# Altium project Sensors_IO_Board.PrjPcb
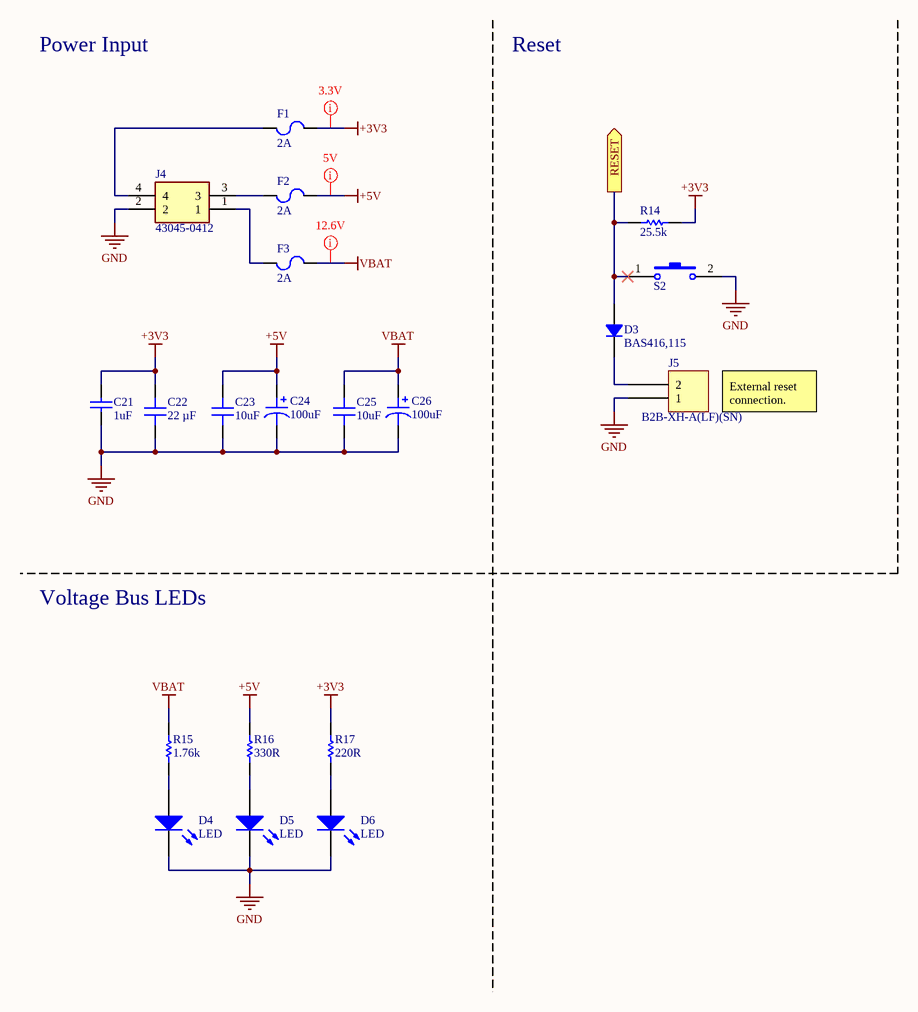
[diagram p0: Power_Reset.SchDoc]
MainProjectName: The ROS Robot Project
8 sheets, 116 parts. Net scope: hierarchical (ports join the sheet entries above them; power ports are global).
Board file: Sensors_IO_Board.PcbDoc
Sheets:
  Power_Reset.SchDoc
  Sensors_IO.SchDoc
    MS1 = Microswitch_Interface.SchDoc
    MS2 = Microswitch_Interface.SchDoc
    MS3 = Microswitch_Interface.SchDoc
    MS4 = Microswitch_Interface.SchDoc
    ULTRA1 = Ultrasonic_Interface.SchDoc
    ULTRA2 = Ultrasonic_Interface.SchDoc
    ULTRA3 = Ultrasonic_Interface.SchDoc
    ULTRA4 = Ultrasonic_Interface.SchDoc
  Aux_Power_Bus.SchDoc
  Temp_Interface.SchDoc
  Neopixel_Interface.SchDoc
  CC_LED_Drive.SchDoc

## Sheet Power_Reset.SchDoc: Power Input & Reset
size A4; DrawnBy: Samyar Sadat Akhavi; Revision: 1.0; SheetNumber: 2; SheetTotal: 13

### Parts
(Parts that share a designator on the sheet are numbered #1, #2 ... from top to bottom, then left to right.)
?#1  (no value)  (graphical)
C21  1uF  [CAP_SMD_805]
C22  22 µF  [CAP 0805_2012]
C23  10uF  [CAP 0805_2012]
C24  100uF  [CAP ALSMD 5.3MM H5.4MM]
C25  10uF  [CAP 0805_2012]
C26  100uF  [CAP ALSMD 6.6MM H5.4MM]
D3  BAS416,115  [SOD323 IPC]
D4  LED  [LED_1206]
D5  LED  [LED_1206]
D6  LED  [LED_1206]
F1  Current Rating (Amps): 2A  [FUSE 1206_3216 0.6MM]  (hidden comment: SF-1206F200-2)
F2  Current Rating (Amps): 2A  [FUSE 1206_3216 0.6MM]  (hidden comment: SF-1206F200-2)
F3  Current Rating (Amps): 2A  [FUSE 1206_3216 0.6MM]  (hidden comment: SF-1206F200-2)
J4  43045-0412  [43045-04YY_121314]
J5  B2B-XH-A(LF)(SN)  [JST XH B2B-XH-A]
R14  25.5k  [RES_0603]
R15  1.76k  [RES_0603]
R16  330R  [RES_0603]
R17  220R  [RES_0603]
S2  PTS815_SJK_250_SMTR_LFS  [PTS815SJK250SMTRLFS]  (value not drawn)

### Ports
RESET (out, see Sensors_IO_Board[2A])

### Nets
+3V3: C21.2 C22.2 F1.2 R14.2 R17.1
+5V: C23.2 C24.1 F2.2 R16.1
GND: C21.1 C22.1 C23.1 C24.2 C25.1 C26.2 D4.2(K) D5.2(K) D6.2(K) J4.2 J5.1 S2.2(NO)
VBAT: C25.2 C26.1 F3.2 R15.1
NetD3_1: D3.1 J5.2
NetD3_2: D3.2 R14.1 S2.1(COM) ; port RESET
NetD4_1: D4.1(A) R15.2
NetD5_1: D5.1(A) R16.2
NetD6_1: D6.1(A) R17.2
NetF1_1: F1.1 J4.4
NetF2_1: F2.1 J4.3
NetF3_1: F3.1 J4.1

### Layout directives
rule Supply Nets [Voltage = 5.000]: +5V
rule Supply Nets [Voltage = 3.300]: +3V3
rule Supply Nets [Voltage = 12.60]: VBAT

### Notes on the sheet
- Power Input
- Reset
- External reset connection.
- Voltage Bus LEDs
- Sub-Project:
- Size:
- Drawn By:
- Revision:
- Date:
- File:
- Sheet:
- of

### Library data of the parts
?#1 = Standard Title Block
C21 = Non-polar Capacitor: Generic Ceramic Capacitor; Voltage: 16V; Value: 1uF
C22 = CL21A226MAYNNNE: CAP CER 22UF 25V X5R 0805; manufacturer: Samsung Electro-Mechanics; Tolerance: ±20%; Part Number: CL21A226MAYNNNE; Capacitance: 22 µF; Applications: General Purpose; componentlink1description: Datasheet; componentlink1url: https://media.digikey.com/pdf/Data%20Sheets/Samsung%20PDFs/CL21A226MAYNNNE_Spec.pdf; componentlink2description: DigiKey Link; componentlink2url: https://www.digikey.com/en/products/detail/samsung-electro-mechanics/CL21A226MAYNNNE/10479857; Device Package: 0805 (2012 Metric); lastupdated: 2/9/2024 8:15:02 PM; Lifecycle Status: Active; Minimum Order: 1; Mounting Type: Surface Mount, MLCC; Operating Temperature: -55°C ~ 85°C; Package / Case: 0805 (2012 Metric); packaging: TapeAndReel; partid: 39209; Part Status: Active; price: 0.04; series: CL; Size / Dimension: 0.079" L x 0.049" W (2.00mm x 1.25mm); Supplier 1: DigiKey; Supplier Part Number 1: 1276-CL21A226MAYNNNECT-ND; Temperature Coefficient: X5R; Thickness (Max): 0.057" (1.45mm); value: 22 µF; Voltage - Rated: 25V
C23 C25 = CL21A106KOQNNNE: CAP CER 10UF 16V X5R 0805; manufacturer: Samsung Electro-Mechanics; Capacitance: 10 µF; Tolerance: ±10%; Part Number: CL21A106KOQNNNE; Applications: General Purpose; componentlink1description: Datasheet; componentlink1url: http://www.samsungsem.com/kr/support/product-search/mlcc/CL21A106KOQNNNE.jsp; componentlink2description: DigiKey Link; componentlink2url: https://www.digikey.com/en/products/detail/samsung-electro-mechanics/CL21A106KOQNNNE/3886754; Device Package: 0805 (2012 Metric); lastupdated: 2/9/2024 8:15:37 PM; Lifecycle Status: Active; Minimum Order: 1; Mounting Type: Surface Mount, MLCC; Operating Temperature: -55°C ~ 85°C; Package / Case: 0805 (2012 Metric); packaging: TapeAndReel; partid: 14297; Part Status: Active; price: 0.01; series: CL; Size / Dimension: 0.079" L x 0.049" W (2.00mm x 1.25mm); Supplier 1: DigiKey; Supplier Part Number 1: 1276-1096-1-ND; Temperature Coefficient: X5R; Thickness (Max): 0.055" (1.40mm); value: 10uF; Voltage - Rated: 16V
C24 = 865080142007: CAP ALUM 100UF 20% 6.3V SMD; manufacturer: Würth Elektronik; Capacitance: 100 µF; Impedance: 800 mOhms; Lifetime @ Temp.: 2000 Hrs @ 105°C; Polarization: Polar; Ripple Current @ High Frequency: 170 mA @ 100 kHz; Ripple Current @ Low Frequency: 110.5 mA @ 120 Hz; Surface Mount Land Size: 0.209" L x 0.209" W (5.30mm x 5.30mm); Part Number: 865080142007; Applications: General Purpose; componentlink1description: Datasheet; componentlink1url: https://katalog.we-online.de/pbs/datasheet/865080142007.pdf; componentlink2description: DigiKey Link; componentlink2url: https://www.digikey.com/en/products/detail/würth-elektronik/865080142007/5728067; Device Package: Radial, Can - SMD; Height - Seated (Max): 0.217" (5.50mm); lastupdated: 6/3/2024 7:53:12 PM; Lifecycle Status: Active; Minimum Order: 1; Mounting Type: Surface Mount; Operating Temperature: -55°C ~ 105°C; Package / Case: Radial, Can - SMD; packaging: TapeAndReel; partid: 7920; Part Status: Active; price: 0.12; series: WCAP-ASLI; Size / Dimension: 0.197" Dia (5.00mm); Supplier 1: DigiKey; Supplier Part Number 1: 732-8472-1-ND; Tolerance: ±20%; value: 100uF; Voltage - Rated: 6.3 V
C26 = 865080343009: CAP ALUM 100UF 20% 16V SMD; manufacturer: Würth Elektronik; Impedance: 520 mOhms; Lifetime @ Temp.: 2000 Hrs @ 105°C; Polarization: Polar; Ripple Current @ High Frequency: 255 mA @ 100 kHz; Ripple Current @ Low Frequency: 165.75 mA @ 120 Hz; Surface Mount Land Size: 0.260" L x 0.260" W (6.60mm x 6.60mm); Part Number: 865080343009; Applications: General Purpose; Capacitance: 100uF; componentlink1description: Datasheet; componentlink1url: https://katalog.we-online.de/pbs/datasheet/865080343009.pdf; componentlink2description: DigiKey Link; componentlink2url: https://www.digikey.com/en/products/detail/würth-elektronik/865080343009/5728014; Device Package: Radial, Can - SMD; Height - Seated (Max): 0.217" (5.50mm); lastupdated: 6/3/2024 7:53:35 PM; Lifecycle Status: Active; Minimum Order: 1; Mounting Type: Surface Mount; Operating Temperature: -55°C ~ 105°C; Package / Case: Radial, Can - SMD; packaging: TapeAndReel; partid: 8820; Part Status: Active; price: 0.16; series: WCAP-ASLI; Size / Dimension: 0.248" Dia (6.30mm); Supplier 1: DigiKey; Supplier Part Number 1: 732-8419-1-ND; Tolerance: ±20%; value: 100uF; Voltage - Rated: 16 V
D3 = BAS416,115: DIODE STANDARD 75V 200MA SOD323; Manufacturer: Nexperia USA Inc.; Capacitance @ Vr, F: 2pF @ 0V, 1MHz; Current - Reverse Leakage @ Vr: 5 nA @ 75 V; Reverse Recovery Time (trr): 3 µs; Speed: Small Signal =< 200mA (Io), Any Speed; Voltage - Forward (Vf) (Max) @ If: 1.25 V @ 150 mA; Part Number: BAS416,115; ComponentLink1Description: Datasheet; ComponentLink1URL: https://assets.nexperia.com/documents/data-sheet/BAS416.pdf; ComponentLink2Description: DigiKey Link; ComponentLink2URL: https://www.digikey.com/en/products/detail/nexperia-usa-inc/BAS416-115/1232094; Current - Average Rectified (Io): 200mA; Diode Type: Standard; LastUpdated: 10/27/2025 1:55:14 PM; Lifecycle Status: Active; Minimum Order: 1; Mounting Type: Surface Mount; Operating Temperature - Junction: 150°C (Max); Package / Case: SC-76, SOD-323; Packaging: TapeAndReel; PartId: 2951; Part Status: Active; Price: 0.02; Series: -; Supplier 1: DigiKey; Supplier Part Number 1: 1727-4807-1-ND; Supplier Device Package: SOD-323; Voltage - DC Reverse (Vr) (Max): 75 V
D4-D6 = LED: Indicator LED; Color: Blue
F1-F3 = SF-1206F200-2: FUSE BOARD MOUNT 2A 63VDC 1206; Manufacturer: Bourns Inc.; Approval Agency: UL; Breaking Capacity @ Rated Voltage: 50A; Fuse Type: Board Mount (Cartridge Style Excluded); Melting I²t: 0.181; Response Time: Fast Blow; Voltage Rating - DC: 63V; Part Number: SF-1206F200-2; Approvals: UL; ComponentLink1Description: Datasheet; ComponentLink1URL: https://www.bourns.com/pdfs/SF1206F.pdf; ComponentLink2Description: DigiKey Link; ComponentLink2URL: http://digikey.com/product-detail/en/bourns-inc/SF-1206F200-2/SF-1206F200-2CT-ND/1948205; Device Package: 1206 (3216 Metric); LastUpdated: 9/2/2020 1:30:42 AM; Lifecycle Status: Active; Minimum Order: 1; Mounting Type: Surface Mount; Operating Temperature: -40°C ~ 105°C; Package / Case: 1206 (3216 Metric); Packaging: TapeAndReel; Part Status: Active; Price: 0.31; Series: SinglFuse™ SF-1206F; Size / Dimension: 0.122" L x 0.061" W x 0.024" H (3.10mm x 1.55mm x 0.60mm); Supplier 1: DigiKey; Supplier Part Number 1: SF-1206F200-2CT-ND
J4 = 43045-0412: Connector; Manufacturer_Name: Molex; Datasheet Link: https://www.molex.com/pdm_docs/sd/430450612_sd.pdf; Height: 9.91mm; Manufacturer_Part_Number: 43045-0412; Mouser Part Number: 538-43045-0412; Mouser Price/Stock: https://www.mouser.co.uk/ProductDetail/Molex/43045-0412?qs=UeCeOHRHQebPBbEMDLocEw%3D%3D; Arrow Part Number: 43045-0412; Arrow Price/Stock: https://www.arrow.com/en/products/43045-0412/molex?utm_currency=USD&region=nac
J5 = B2B-XH-A(LF)(SN): CONN HEADER VERT 2POS 2.5MM; Manufacturer: JST Sales America Inc.; Contact Length - Post: 0.134" (3.40mm); Current Rating (Amps): 3A; Material Flammability Rating: UL94 V-0; Number of Positions: 2; Number of Positions Loaded: All; Pitch - Mating: 0.098" (2.50mm); Shrouding: Shrouded - 4 Wall; Style: Board to Cable/Wire; Voltage Rating: 250V; Part Number: B2B-XH-A(LF)(SN); ComponentLink1Description: Datasheet; ComponentLink1URL: http://www.jst-mfg.com/product/pdf/eng/eXH.pdf; ComponentLink2Description: DigiKey Link; ComponentLink2URL: http://digikey.com/product-detail/en/jst-sales-america-inc/B2B-XH-A-LF-SN/455-2247-ND/1651045; Connector Type: Header; Contact Finish - Mating: Tin; Contact Finish - Post: Tin; Contact Material: Brass; Contact Shape: Square; Contact Type: Male Pin; Fastening Type: Detent Lock; Insulation Color: Natural; Insulation Height: 0.276" (7.00mm); Insulation Material: Polyamide (PA66), Nylon 6/6; LastUpdated: 1/12/2020 11:46:08 PM; Lifecycle Status: Active; Minimum Order: 1; Mounting Type: Through Hole; Number of Rows: 1; Operating Temperature: -25°C ~ 85°C; Packaging: Bulk; PartId: 67; Part Status: Active; Price: 0.15; Series: XH; Supplier 1: DigiKey; Supplier Part Number 1: 455-2247-ND; Termination: Press-Fit, Solder
R14-R17 = Resistor: Power: 1/8W
  R14: Value: 25.5k
  R15: Value: 1.76k
  R16: Value: 330R
  R17: Value: 220R
S2 = PTS815_SJK_250_SMTR_LFS: Switch; Manufacturer_Name: C & K COMPONENTS; Manufacturer_Part_Number: PTS815 SJK 250 SMTR LFS; Datasheet Link: https://www.mouser.com/datasheet/2/60/pts815-1535658.pdf; Height: 2mm; Mouser Part Number: 611-PTS815SJK250SMTR; Mouser Price/Stock: https://www.mouser.co.uk/ProductDetail/CK/PTS815-SJK-250-SMTR-LFS?qs=ahcBuItHZ3yETpGYMHf%2FgQ%3D%3D; Arrow Part Number: PTS815 SJK 250 SMTR LFS; Arrow Price/Stock: https://www.arrow.com/en/products/pts815-sjk-250-smtr-lfs/ck

## Sheet Sensors_IO.SchDoc: Internal Sensors IO
size A4; DrawnBy: Samyar Sadat Akhavi; Revision: 1.0; SheetNumber: 4; SheetTotal: 12
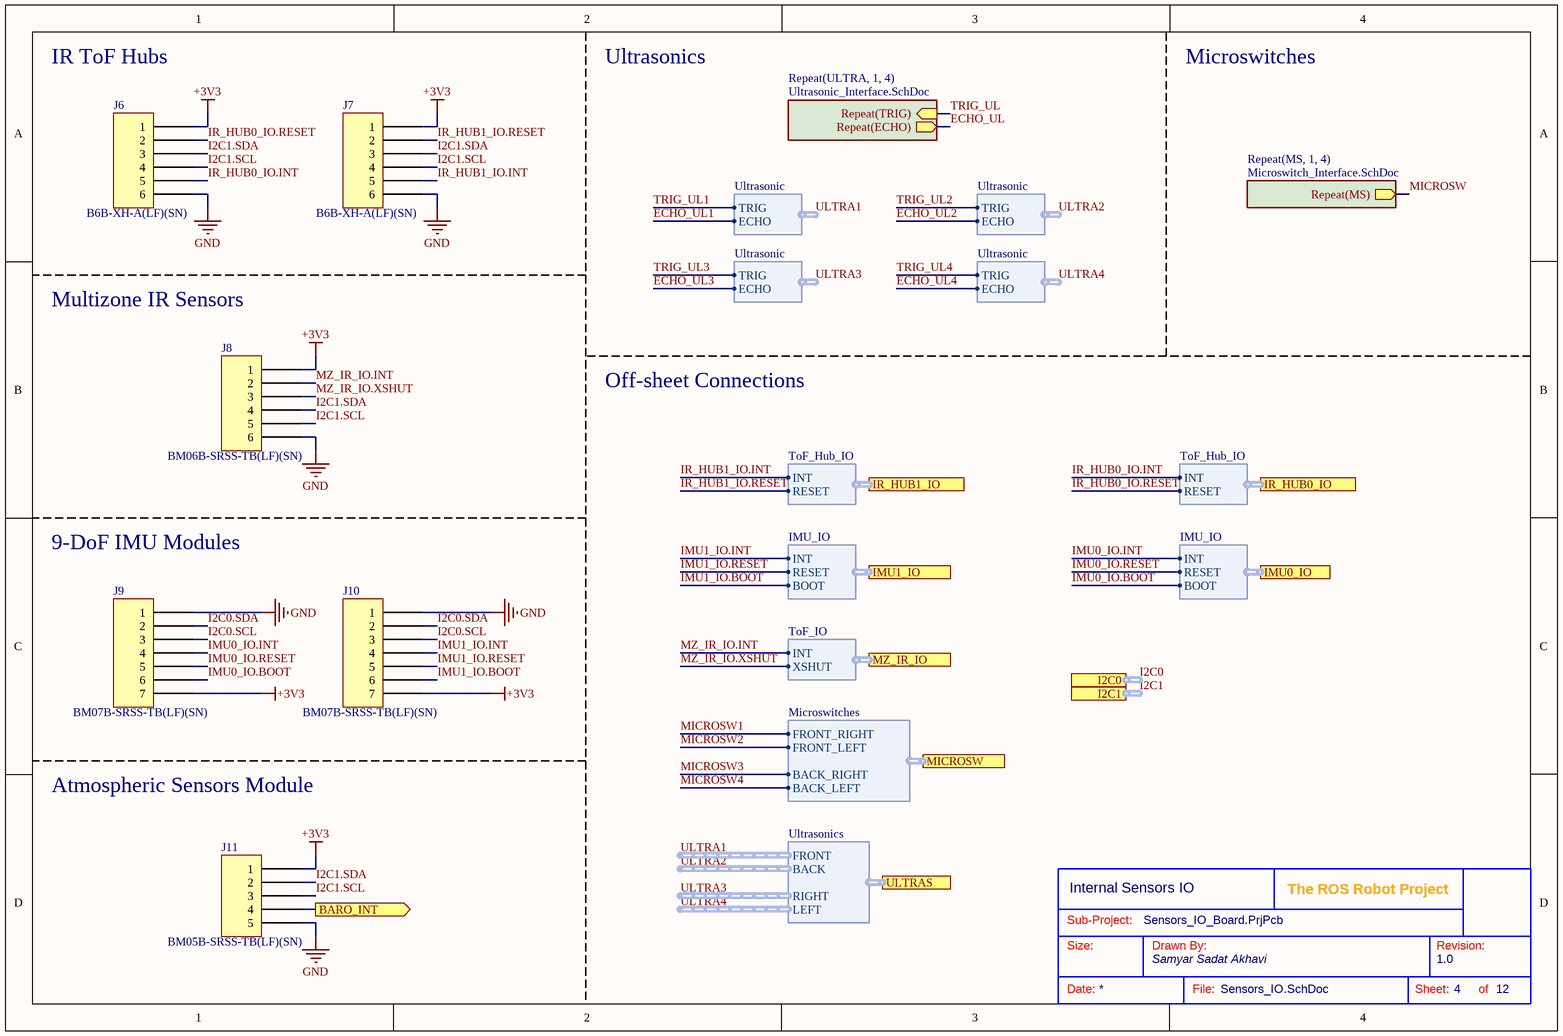
[diagram p1: Sensors_IO.SchDoc]

### Parts
(Parts that share a designator on the sheet are numbered #1, #2 ... from top to bottom, then left to right.)
?#2  (no value)  (graphical)
J6  B6B-XH-A(LF)(SN)  [JST XH B6B-XH-A]
J7  B6B-XH-A(LF)(SN)  [JST XH B6B-XH-A]
J8  BM06B-SRSS-TB(LF)(SN)  [JST BM06B-SRSS-TB]
J9  BM07B-SRSS-TB(LF)(SN)  [JST BM07B-SRSS-TB]
J10  BM07B-SRSS-TB(LF)(SN)  [JST BM07B-SRSS-TB]
J11  BM05B-SRSS-TB(LF)(SN)  [JST BM05B-SRSS-TB]

### Sub-sheets
Repeat(MS, 1, 4) = Microswitch_Interface.SchDoc: Repeat(MS) (out)
Repeat(ULTRA, 1, 4) = Ultrasonic_Interface.SchDoc: Repeat(TRIG) (in), Repeat(ECHO) (out)

### Ports
BARO_INT (out, see Sensors_IO_Board[2B], Microcontroller[3B]), I2C0 (harness I2C, see Sensors_IO_Board[2B], Aux_Power_Bus[4C], Microcontroller[5C], Thermal[4C]), I2C1 (harness I2C, see Sensors_IO_Board[2B], Microcontroller[6C], Thermal[4C]), IMU0_IO (harness IMU_IO, see Sensors_IO_Board[2B], Microcontroller[3B]), IMU1_IO (harness IMU_IO, see Sensors_IO_Board[2B], Microcontroller[3B]), IR_HUB0_IO (harness TOF_HUB_IO, see Sensors_IO_Board[2B], Microcontroller[3B]), IR_HUB1_IO (harness TOF_HUB_IO, see Sensors_IO_Board[2B], Microcontroller[3B]), MICROSW (harness Microswitches, see Sensors_IO_Board[2B], Microcontroller[3B]), MZ_IR_IO (harness TOF_IO, see Sensors_IO_Board[2B], Microcontroller[3B]), ULTRAS (harness Ultrasonics, see Sensors_IO_Board[2B], Microcontroller[3B])

### Harnesses
Microswitches: BACK_LEFT, FRONT_RIGHT, FRONT_LEFT, BACK_RIGHT
IMU_IO: INT, RESET, BOOT
ToF_IO: INT, XSHUT
ToF_Hub_IO: INT, RESET
Ultrasonics: LEFT, FRONT, BACK, RIGHT
Ultrasonic: TRIG, ECHO

### Nets
+3V3: J6.1 J7.1 J8.1 J9.7 J10.7 J11.1
GND: J6.6 J7.6 J8.6 J9.1 J10.1 J11.5
ECHO_UL: sheet Repeat(ULTRA, 1, 4)/Repeat(ECHO)
I2C0.SCL: J9.3 J10.3
I2C0.SDA: J9.2 J10.2
I2C1.SCL: J6.4 J7.4 J8.5 J11.3
I2C1.SDA: J6.3 J7.3 J8.4 J11.2
IMU0_IO.BOOT: J9.6 ; port IMU0_IO.BOOT
IMU0_IO.INT: J9.4 ; port IMU0_IO.INT
IMU0_IO.RESET: J9.5 ; port IMU0_IO.RESET
IMU1_IO.BOOT: J10.6 ; port IMU1_IO.BOOT
IMU1_IO.INT: J10.4 ; port IMU1_IO.INT
IMU1_IO.RESET: J10.5 ; port IMU1_IO.RESET
IR_HUB0_IO.INT: J6.5 ; port IR_HUB0_IO.INT
IR_HUB0_IO.RESET: J6.2 ; port IR_HUB0_IO.RESET
IR_HUB1_IO.INT: J7.5 ; port IR_HUB1_IO.INT
IR_HUB1_IO.RESET: J7.2 ; port IR_HUB1_IO.RESET
MICROSW: sheet Repeat(MS, 1, 4)/Repeat(MS)
MZ_IR_IO.INT: J8.2 ; port MZ_IR_IO.INT
MZ_IR_IO.XSHUT: J8.3 ; port MZ_IR_IO.XSHUT
TRIG_UL: sheet Repeat(ULTRA, 1, 4)/Repeat(TRIG)
NetJ11_4: J11.4 ; port BARO_INT

### Buses and harness runs
harness I2C0 = port I2C0
harness I2C1 = port I2C1

### Notes on the sheet
- IR ToF Hubs
- Ultrasonics
- Microswitches
- Multizone IR Sensors
- Off-sheet Connections
- 9-DoF IMU Modules
- Atmospheric Sensors Module
- Sub-Project:
- Size:
- Drawn By:
- Revision:
- Date:
- File:
- Sheet:
- of

### Library data of the parts
?#2 = Standard Title Block
J6 J7 = B6B-XH-A(LF)(SN): CONN HEADER VERT 6POS 2.5MM; Manufacturer: JST Sales America Inc.; Contact Length - Post: 0.134" (3.40mm); Current Rating (Amps): 3A; Material Flammability Rating: UL94 V-0; Number of Positions: 6; Number of Positions Loaded: All; Pitch - Mating: 0.098" (2.50mm); Shrouding: Shrouded - 4 Wall; Style: Board to Cable/Wire; Voltage Rating: 250V; Part Number: B6B-XH-A(LF)(SN); ComponentLink1Description: Datasheet; ComponentLink1URL: http://www.jst-mfg.com/product/pdf/eng/eXH.pdf; ComponentLink2Description: DigiKey Link; ComponentLink2URL: http://digikey.com/product-detail/en/jst-sales-america-inc/B6B-XH-A-LF-SN/455-2271-ND/1000381; Connector Type: Header; Contact Finish - Mating: Tin; Contact Finish - Post: Tin; Contact Material: Brass; Contact Shape: Square; Contact Type: Male Pin; Fastening Type: Detent Lock; Insulation Color: Natural; Insulation Height: 0.276" (7.00mm); Insulation Material: Polyamide (PA66), Nylon 6/6; LastUpdated: 1/12/2020 11:46:58 PM; Lifecycle Status: Active; Minimum Order: 1; Mounting Type: Through Hole; Number of Rows: 1; Operating Temperature: -25°C ~ 85°C; Packaging: Bulk; PartId: 71; Part Status: Active; Price: 0.27; Series: XH; Supplier 1: DigiKey; Supplier Part Number 1: 455-2271-ND; Termination: Press-Fit, Solder
J8 = BM06B-SRSS-TB(LF)(SN): CONN HEADER SMD 6POS 1MM; Manufacturer: JST Sales America Inc.; Current Rating (Amps): 0.7A; Material Flammability Rating: UL94 V-0; Number of Positions: 6; Number of Positions Loaded: All; Pitch - Mating: 0.039" (1.00mm); Shrouding: Shrouded - 4 Wall; Style: Board to Cable/Wire; Voltage Rating: 50V; Part Number: BM06B-SRSS-TB(LF)(SN); ComponentLink1Description: Datasheet; ComponentLink1URL: http://www.jst-mfg.com/product/pdf/eng/eSH.pdf; ComponentLink2Description: DigiKey Link; ComponentLink2URL: http://digikey.com/product-detail/en/jst-sales-america-inc/BM06B-SRSS-TB-LF-SN/455-1792-1-ND/926863; Connector Type: Header; Contact Finish - Mating: Tin; Contact Finish - Post: Tin; Contact Material: Copper Alloy; Contact Shape: Square; Contact Type: Male Pin; Fastening Type: Push-Pull; Features: Solder Retention; Insulation Color: Natural; Insulation Height: 0.167" (4.25mm); Insulation Material: Polyamide (PA), Nylon; LastUpdated: 1/12/2020 10:14:30 PM; Lifecycle Status: Active; Minimum Order: 1; Mounting Type: Surface Mount; Number of Rows: 1; Operating Temperature: -25°C ~ 85°C; Packaging: TapeAndReel; PartId: 20; Part Status: Active; Price: 0.38; Series: SR; Supplier 1: DigiKey; Supplier Part Number 1: 455-1792-1-ND; Termination: Solder
J9 J10 = BM07B-SRSS-TB(LF)(SN): CONN HEADER SMD 7POS 1MM; Manufacturer: JST Sales America Inc.; Current Rating (Amps): 0.7A; Material Flammability Rating: UL94 V-0; Number of Positions: 7; Number of Positions Loaded: All; Pitch - Mating: 0.039" (1.00mm); Shrouding: Shrouded - 4 Wall; Style: Board to Cable/Wire; Voltage Rating: 50V; Part Number: BM07B-SRSS-TB(LF)(SN); ComponentLink1Description: Datasheet; ComponentLink1URL: http://www.jst-mfg.com/product/pdf/eng/eSH.pdf; ComponentLink2Description: DigiKey Link; ComponentLink2URL: http://digikey.com/product-detail/en/jst-sales-america-inc/BM07B-SRSS-TB-LF-SN/455-1793-1-ND/926864; Connector Type: Header; Contact Finish - Mating: Tin; Contact Finish - Post: Tin; Contact Material: Copper Alloy; Contact Shape: Square; Contact Type: Male Pin; Fastening Type: Push-Pull; Features: Solder Retention; Insulation Color: Natural; Insulation Height: 0.167" (4.25mm); Insulation Material: Polyamide (PA), Nylon; LastUpdated: 1/12/2020 10:15:04 PM; Lifecycle Status: Active; Minimum Order: 1; Mounting Type: Surface Mount; Number of Rows: 1; Operating Temperature: -25°C ~ 85°C; Packaging: TapeAndReel; PartId: 22; Part Status: Active; Price: 0.42; Series: SR; Supplier 1: DigiKey; Supplier Part Number 1: 455-1793-1-ND; Termination: Solder
J11 = BM05B-SRSS-TB(LF)(SN): CONN HEADER SMD 5POS 1MM; Manufacturer: JST Sales America Inc.; Current Rating (Amps): 0.7A; Material Flammability Rating: UL94 V-0; Number of Positions: 5; Number of Positions Loaded: All; Pitch - Mating: 0.039" (1.00mm); Shrouding: Shrouded - 4 Wall; Style: Board to Cable/Wire; Voltage Rating: 50V; Part Number: BM05B-SRSS-TB(LF)(SN); ComponentLink1Description: Datasheet; ComponentLink1URL: http://www.jst-mfg.com/product/pdf/eng/eSR.pdf; ComponentLink2Description: DigiKey Link; ComponentLink2URL: http://digikey.com/product-detail/en/jst-sales-america-inc/BM05B-SRSS-TB-LF-SN/455-1791-1-ND/926862; Connector Type: Header; Contact Finish - Mating: Tin; Contact Finish - Post: Tin; Contact Material: Copper Alloy; Contact Shape: Square; Contact Type: Male Pin; Fastening Type: Push-Pull; Features: Solder Retention; Insulation Color: Natural; Insulation Height: 0.167" (4.25mm); Insulation Material: Polyamide (PA), Nylon; LastUpdated: 1/12/2020 10:14:00 PM; Lifecycle Status: Active; Minimum Order: 1; Mounting Type: Surface Mount; Number of Rows: 1; Operating Temperature: -25°C ~ 85°C; Packaging: TapeAndReel; PartId: 18; Part Status: Active; Price: 0.35; Series: SR; Supplier 1: DigiKey; Supplier Part Number 1: 455-1791-1-ND; Termination: Solder

## Sheet Microswitch_Interface.SchDoc: Microswitch Interface
size A4; DrawnBy: Samyar Sadat Akhavi; Revision: 1.0; SheetNumber: 7; SheetTotal: 14
Used 4 times, as channels MS1, MS2, MS3, MS4. Parts and nets are listed once, with the designators drawn on the sheet.
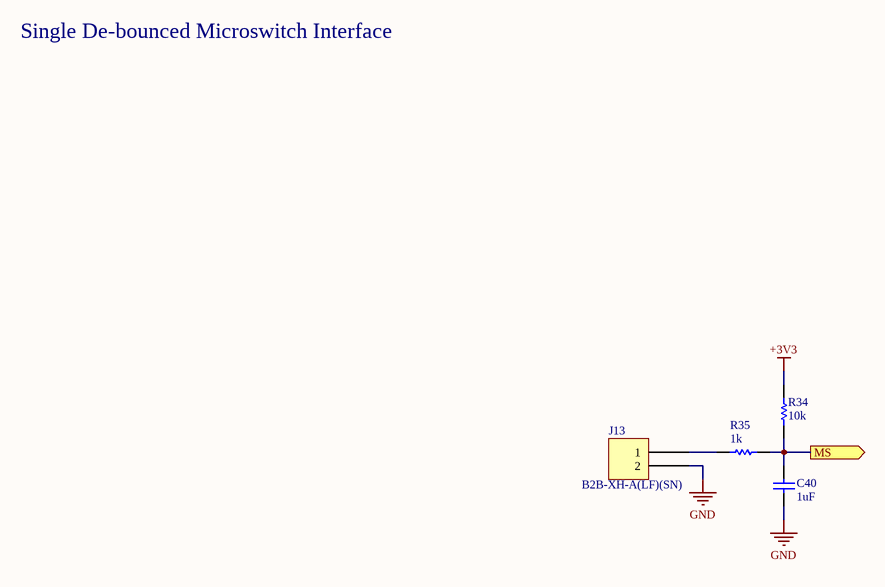
[diagram p2: Microswitch_Interface.SchDoc]

### Parts
?  (no value)  (graphical)
C40  1uF  [CAP_SMD_603]
J13  B2B-XH-A(LF)(SN)  [JST XH B2B-XH-A]
R34  10k  [RES_0603]
R35  1k  [RES_0603]

### Ports
MS (out, see Sensors_IO[4A])

### Nets
+3V3: R34.1
GND: C40.2 J13.2
MS: C40.1 R34.2 R35.1 ; port MS
NetJ13_1: J13.1 R35.2

### Channels
MS1: designators end in _MS1; ports MS=MICROSW1
MS2: designators end in _MS2; ports MS=MICROSW2
MS3: designators end in _MS3; ports MS=MICROSW3
MS4: designators end in _MS4; ports MS=MICROSW4

### Notes on the sheet
- Single De-bounced Microswitch Interface
- Sub-Project:
- Size:
- Drawn By:
- Revision:
- Date:
- File:
- Sheet:
- of

### Library data of the parts
? = Standard Title Block
C40 = Non-polar Capacitor: Generic Ceramic Capacitor; Voltage: 6.3V; Value: 1uF
J13 = B2B-XH-A(LF)(SN): as J5 on sheet Power_Reset; Part Number: B2B-XH-A(LF)(SN); ComponentLink1Description: Datasheet; ComponentLink1URL: http://www.jst-mfg.com/product/pdf/eng/eXH.pdf; ComponentLink2Description: DigiKey Link; ComponentLink2URL: http://digikey.com/product-detail/en/jst-sales-america-inc/B2B-XH-A-LF-SN/455-2247-ND/1651045; Connector Type: Header; Contact Finish - Mating: Tin; Contact Finish - Post: Tin; Contact Material: Brass; Contact Shape: Square; Contact Type: Male Pin; Fastening Type: Detent Lock; Insulation Color: Natural; Insulation Height: 0.276" (7.00mm); Insulation Material: Polyamide (PA66), Nylon 6/6; LastUpdated: 1/12/2020 11:46:08 PM; Lifecycle Status: Active; Minimum Order: 1; Mounting Type: Through Hole; Number of Rows: 1; Operating Temperature: -25°C ~ 85°C; Packaging: Bulk; PartId: 67; Part Status: Active; Price: 0.15; Series: XH; Supplier 1: DigiKey; Supplier Part Number 1: 455-2247-ND; Termination: Press-Fit, Solder
R34 R35 = Resistor: Power: 1/8W
  R34: Value: 10k
  R35: Value: 1k

## Sheet Ultrasonic_Interface.SchDoc: 5V Ultrasonic Interface
size A4; DrawnBy: Samyar Sadat Akhavi; Revision: 1.0; SheetNumber: 5; SheetTotal: 13
Used 4 times, as channels ULTRA1, ULTRA2, ULTRA3, ULTRA4. Parts and nets are listed once, with the designators drawn on the sheet.
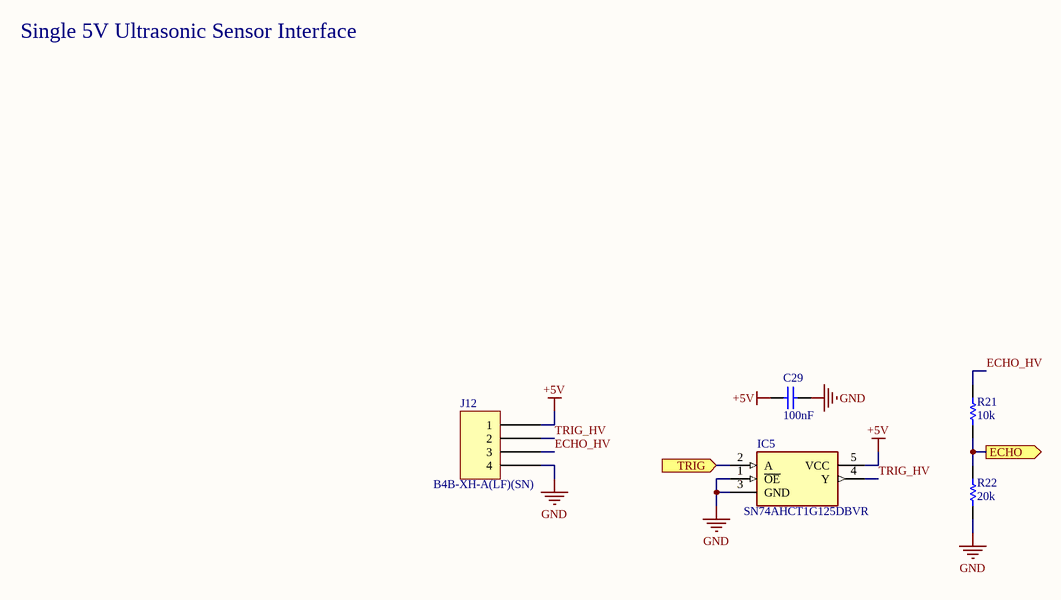
[diagram p3: Ultrasonic_Interface.SchDoc]

### Parts
?  (no value)  (graphical)
C29  100nF  [CAP_SMD_603]
IC5  SN74AHCT1G125DBVR  [SOT95P280X145-5N]
J12  B4B-XH-A(LF)(SN)  [JST XH B4B-XH-A]
R21  10k  [RES_0603]
R22  20k  [RES_0603]

### Ports
ECHO (out, see Sensors_IO[3A]), TRIG (in, see Sensors_IO[3A])

### Nets
+5V: C29.2 IC5.5(VCC) J12.1
GND: C29.1 IC5.1(~{OE}) IC5.3(GND) J12.4 R22.2
ECHO: R21.2 R22.1 ; port ECHO
ECHO_HV: J12.3 R21.1
TRIG: IC5.2(A) ; port TRIG
TRIG_HV: IC5.4(Y) J12.2

### Channels
ULTRA1: designators end in _ULTRA1; ports ECHO=ECHO_UL1 TRIG=TRIG_UL1
ULTRA2: designators end in _ULTRA2; ports ECHO=ECHO_UL2 TRIG=TRIG_UL2
ULTRA3: designators end in _ULTRA3; ports ECHO=ECHO_UL3 TRIG=TRIG_UL3
ULTRA4: designators end in _ULTRA4; ports ECHO=ECHO_UL4 TRIG=TRIG_UL4

### Notes on the sheet
- Single 5V Ultrasonic Sensor Interface
- Sub-Project:
- Size:
- Drawn By:
- Revision:
- Date:
- File:
- Sheet:
- of

### Library data of the parts
? = Standard Title Block
C29 = Non-polar Capacitor: Generic Ceramic Capacitor; Voltage: 6.3V; Value: 100nF
IC5 = SN74AHCT1G125DBVR: Integrated Circuit; Manufacturer_Name: Texas Instruments; Datasheet Link: http://www.ti.com/lit/ds/symlink/sn74ahct1g125.pdf; Height: 1.45mm; Manufacturer_Part_Number: SN74AHCT1G125DBVR; Mouser Part Number: 595-SNAHCT1G125DBVR; Mouser Price/Stock: https://www.mouser.co.uk/ProductDetail/Texas-Instruments/SN74AHCT1G125DBVR?qs=N6WZOzgtpqVaVW8Lh%252BgevA%3D%3D; Arrow Part Number: SN74AHCT1G125DBVR; Arrow Price/Stock: https://www.arrow.com/en/products/sn74ahct1g125dbvr/texas-instruments?utm_currency=USD&region=nac
J12 = B4B-XH-A(LF)(SN): CONN HEADER VERT 4POS 2.5MM; Manufacturer: JST Sales America Inc.; Contact Length - Post: 0.134" (3.40mm); Current Rating (Amps): 3A; Material Flammability Rating: UL94 V-0; Number of Positions: 4; Number of Positions Loaded: All; Pitch - Mating: 0.098" (2.50mm); Shrouding: Shrouded - 4 Wall; Style: Board to Cable/Wire; Voltage Rating: 250V; Part Number: B4B-XH-A(LF)(SN); ComponentLink1Description: Datasheet; ComponentLink1URL: http://www.jst-mfg.com/product/pdf/eng/eXH.pdf; ComponentLink2Description: DigiKey Link; ComponentLink2URL: http://digikey.com/product-detail/en/jst-sales-america-inc/B4B-XH-A-LF-SN/455-2249-ND/1651047; Connector Type: Header; Contact Finish - Mating: Tin; Contact Finish - Post: Tin; Contact Material: Brass; Contact Shape: Square; Contact Type: Male Pin; Fastening Type: Detent Lock; Insulation Color: Natural; Insulation Height: 0.276" (7.00mm); Insulation Material: Polyamide (PA66), Nylon 6/6; LastUpdated: 1/12/2020 11:46:34 PM; Lifecycle Status: Active; Minimum Order: 1; Mounting Type: Through Hole; Number of Rows: 1; Operating Temperature: -25°C ~ 85°C; Packaging: Bulk; PartId: 69; Part Status: Active; Price: 0.21; Series: XH; Supplier 1: DigiKey; Supplier Part Number 1: 455-2249-ND; Termination: Press-Fit, Solder
R21 R22 = Resistor: Power: 1/8W
  R21: Value: 10k
  R22: Value: 20k

## Sheet Aux_Power_Bus.SchDoc: Auxiliary 5V & VBAT Busses
size A4; DrawnBy: Samyar Sadat Akhavi; Revision: 1.0; SheetNumber: 7; SheetTotal: 14
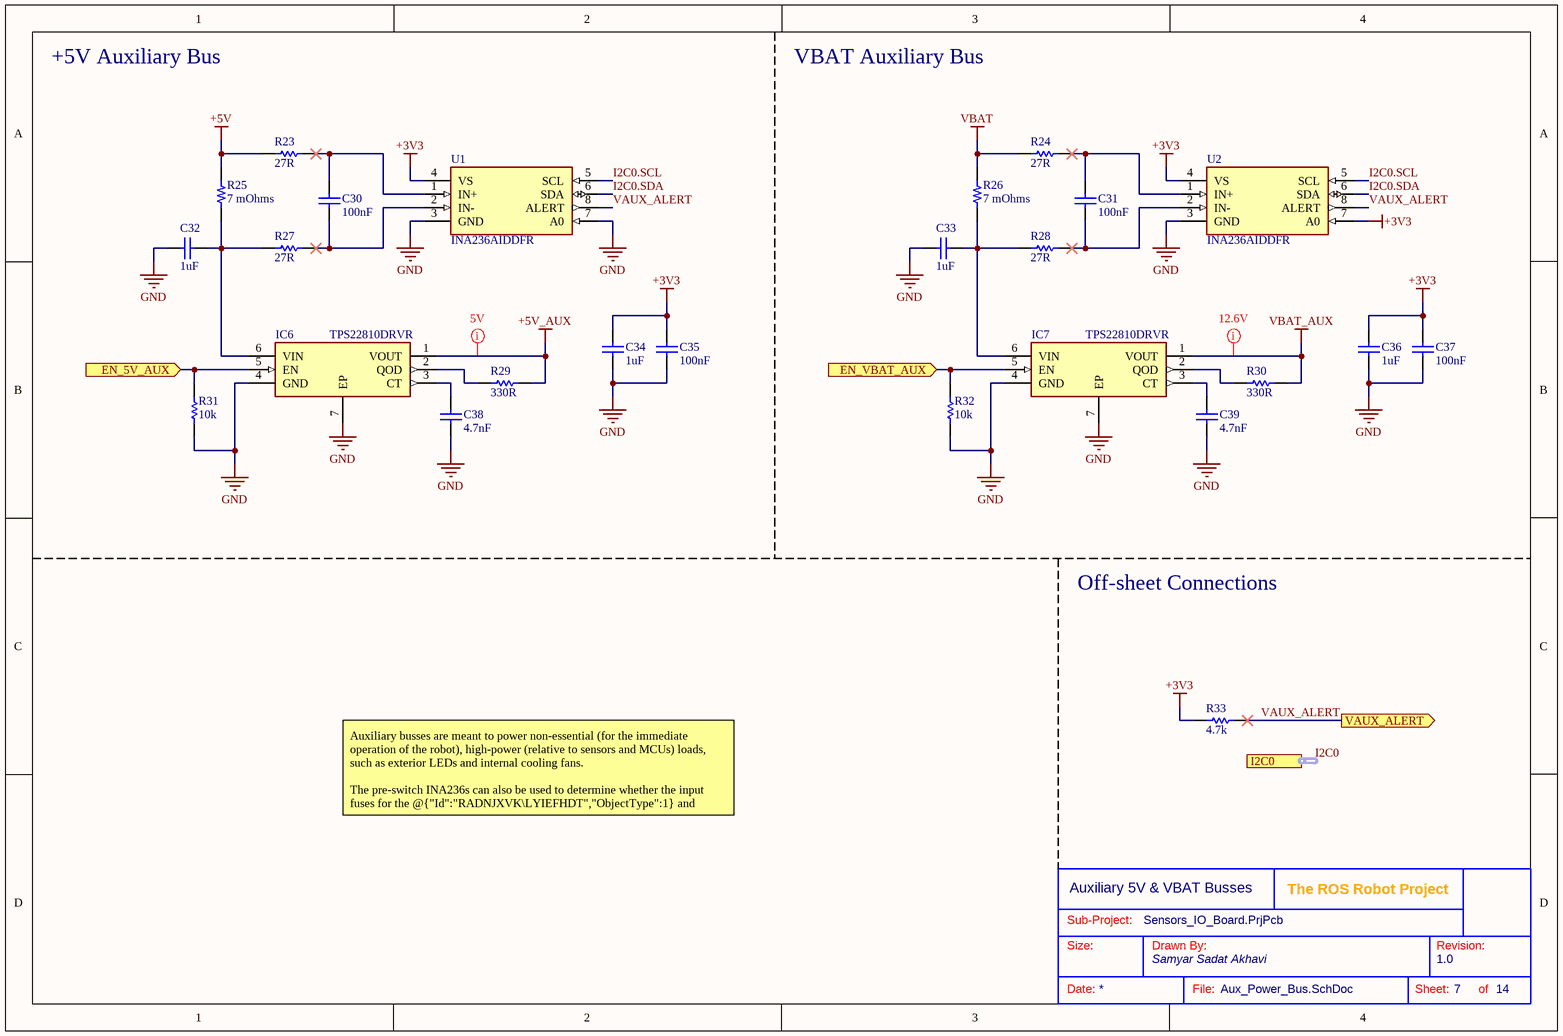
[diagram p4: Aux_Power_Bus.SchDoc]

### Parts
(Parts that share a designator on the sheet are numbered #1, #2 ... from top to bottom, then left to right.)
?#3  (no value)  (graphical)
C30  100nF  [CAP_SMD_603]
C31  100nF  [CAP_SMD_603]
C32  1uF  [CAP_SMD_603]
C33  1uF  [CAP_SMD_603]
C34  1uF  [CAP_SMD_603]
C35  100nF  [CAP_SMD_603]
C36  1uF  [CAP_SMD_603]
C37  100nF  [CAP_SMD_603]
C38  4.7nF  [CAP_SMD_603]
C39  4.7nF  [CAP_SMD_603]
IC6  TPS22810DRVR  [SON65P200X200X80-7N]
IC7  TPS22810DRVR  [SON65P200X200X80-7N]
R23  27R  [RES_0603]
R24  27R  [RES_0603]
R25  7 mOhms  [RES 1206_3216]
R26  7 mOhms  [RES 1206_3216]
R27  27R  [RES_0603]
R28  27R  [RES_0603]
R29  330R  [RES_0603]
R30  330R  [RES_0603]
R31  10k  [RES_0603]
R32  10k  [RES_0603]
R33  4.7k  [RES_0603]
U1  INA236AIDDFR  [SOT23-8_DDF_TEX]
U2  INA236AIDDFR  [SOT23-8_DDF_TEX]

### Ports
EN_5V_AUX (in, see Sensors_IO_Board[3A]), EN_VBAT_AUX (in, see Sensors_IO_Board[3A]), I2C0 (harness I2C, see Sensors_IO_Board[4A], Microcontroller[5C], Sensors_IO[3C], Thermal[4C]), VAUX_ALERT (out, see Sensors_IO_Board[3A], Microcontroller[3C])

### Nets
+3V3: C34.2 C35.1 C36.2 C37.1 R33.1 U1.4(VS) U2.4(VS) U2.7(A0)
+5V: R23.2 R25.2
+5V_AUX: IC6.1(VOUT) R29.1
GND: C32.1 C33.1 C34.1 C35.2 C36.1 C37.2 C38.1 C39.1 IC6.4(GND) IC6.7(EP) IC7.4(GND) IC7.7(EP) R31.2 R32.2 U1.3(GND) U1.7(A0) U2.3(GND)
VBAT: R24.2 R26.2
VBAT_AUX: IC7.1(VOUT) R30.1
I2C0.SCL: U1.5(SCL) U2.5(SCL)
I2C0.SDA: U1.6(SDA) U2.6(SDA)
VAUX_ALERT: R33.2 U1.8(ALERT) U2.8(ALERT) ; port VAUX_ALERT
NetC30_1: C30.1 R23.1 U1.1(IN+)
NetC30_2: C30.2 R27.1 U1.2(IN-)
NetC31_1: C31.1 R24.1 U2.1(IN+)
NetC31_2: C31.2 R28.1 U2.2(IN-)
NetC32_2: C32.2 IC6.6(VIN) R25.1 R27.2
NetC33_2: C33.2 IC7.6(VIN) R26.1 R28.2
NetC38_2: C38.2 IC6.3(CT)
NetC39_2: C39.2 IC7.3(CT)
NetIC6_2: IC6.2(QOD) R29.2
NetIC6_5: IC6.5(EN) R31.1 ; port EN_5V_AUX
NetIC7_2: IC7.2(QOD) R30.2
NetIC7_5: IC7.5(EN) R32.1 ; port EN_VBAT_AUX

### Buses and harness runs
harness I2C0 = port I2C0

### Layout directives
rule Supply Nets [Voltage = 5.000]: +5V_AUX
rule Supply Nets [Voltage = 12.60]: VBAT_AUX

### Notes on the sheet
- +5V Auxiliary Bus
- VBAT Auxiliary Bus
- Off-sheet Connections
- Auxiliary busses are meant to power non-essential (for the immediate operation of the robot), high-power (relative to sensors and MCUs) loads, such as exterior LEDs and internal cooling fans.
  The pre-switch INA236s can also be used to determine whether the input fuses for the @{"Id":"RADNJXVK\LYIEFHDT","ObjectType":1} and @{"Id":"RADNJXVK\DFYGACVF","ObjectType":1} busses have blown or not.
- Sub-Project:
- Size:
- Drawn By:
- Revision:
- Date:
- File:
- Sheet:
- of

### Library data of the parts
?#3 = Standard Title Block
C30 C31 C35 C37-C39 = Non-polar Capacitor: Generic Ceramic Capacitor; Voltage: 6.3V
  C30 C31 C35 C37: Value: 100nF
  C38 C39: Value: 4.7nF
C32 C34 C36 = Non-polar Capacitor: Generic Ceramic Capacitor; Voltage: 16; Value: 1uF
C33 = Non-polar Capacitor: Generic Ceramic Capacitor; Voltage: 16V; Value: 1uF
IC6 IC7 = TPS22810DRVR: Integrated Circuit; Manufacturer_Name: Texas Instruments; Datasheet Link: http://www.ti.com/lit/gpn/tps22810; Height: 0.8mm; Manufacturer_Part_Number: TPS22810DRVR; Mouser Part Number: 595-TPS22810DRVR; Mouser Price/Stock: https://www.mouser.co.uk/ProductDetail/Texas-Instruments/TPS22810DRVR?qs=5aG0NVq1C4wkfnc1%252B6LezA%3D%3D; Arrow Part Number: TPS22810DRVR; Arrow Price/Stock: https://www.arrow.com/en/products/tps22810drvr/texas-instruments?region=nac
R23 R24 R27 R28 R31-R33 = Resistor: Power: 1/8W
  R23 R24 R27 R28: Value: 27R
  R31 R32: Value: 10k
  R33: Value: 4.7k
R25 R26 = TLR2B10DR007FTDG: RES 0.007 OHM 1% 1W 1206; Manufacturer: TE Connectivity Passive Product; Temperature Coefficient: ±50ppm/°C; Part Number: TLR2B10DR007FTDG; ComponentLink1Description: Datasheet; ComponentLink1URL: https://www.te.com/commerce/DocumentDelivery/DDEController?Action=srchrtrv&DocNm=1773449-3&DocType=DS&DocLang=English; ComponentLink2Description: DigiKey Link; ComponentLink2URL: https://www.digikey.com/en/products/detail/te-connectivity-passive-product/TLR2B10DR007FTDG/5584869; Composition: Metal Foil; Device Package: 1206 (3216 Metric); Features: Current Sense; Height - Seated (Max): 0.024" (0.60mm); LastUpdated: 2/9/2024 8:54:43 PM; Lifecycle Status: Active; Minimum Order: 1; Number of Terminations: 2; Operating Temperature: -55°C ~ 170°C; Package / Case: 1206 (3216 Metric); Packaging: TapeAndReel; PartId: 27144; Part Status: Active; Power (Watts): 1W; Price: 0.31; Resistance: 7 mOhms; Series: TLR, CGS; Size / Dimension: 0.126" L x 0.063" W (3.20mm x 1.60mm); Supplier 1: DigiKey; Supplier Part Number 1: A131747CT-ND; Supplier Device Package: 1206; Tolerance: ±1%; Value: 7 mOhms
R29 R30 = Resistor: Power: 1/4W; Value: 330R
U1 U2 = INA236AIDDFR: 48-V, 16-bit ultraprecise IÂ²C output digital power monitor with alert in WCSP 8-SOT-23-THIN -40 to 125; Manufacturer_Name: Texas Instruments; Type: Power Management; Copyright: Copyright (C) 2025 Ultra Librarian. All rights reserved.; Manufacturer_Part_Number: INA236AIDDFR; RefDes: RefDes

## Sheet Temp_Interface.SchDoc: NTC Thermistor Interface
size A4; DrawnBy: Samyar Sadat Akhavi; Revision: 1.0; SheetNumber: 9; SheetTotal: 13
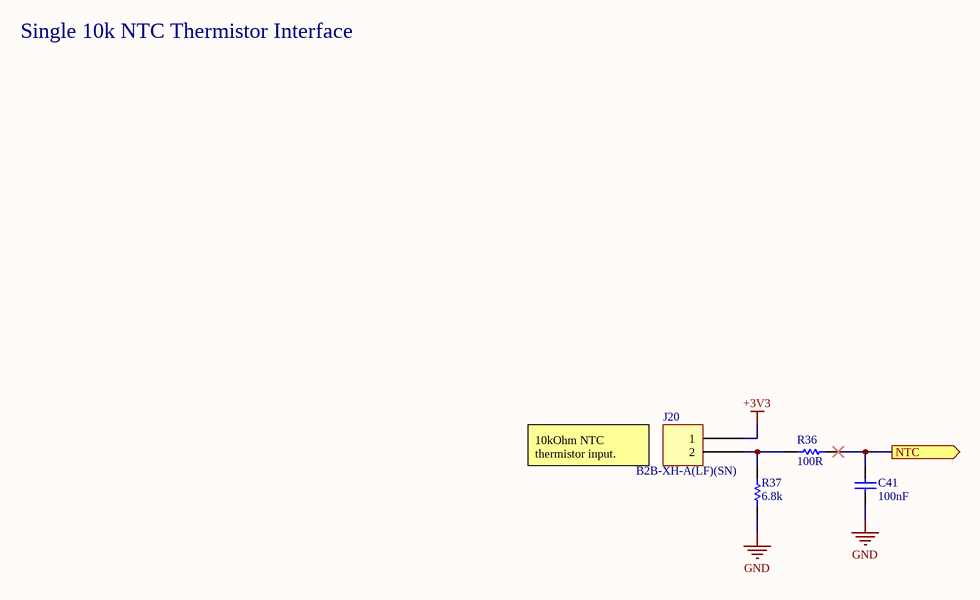
[diagram p5: Temp_Interface.SchDoc]

### Parts
(Parts that share a designator on the sheet are numbered #1, #2 ... from top to bottom, then left to right.)
?#4  (no value)  (graphical)
C41  100nF  [CAP_SMD_603]
J20  B2B-XH-A(LF)(SN)  [JST XH B2B-XH-A]
R36  100R  [RES_0603]
R37  6.8k  [RES_0603]

### Ports
NTC (out, see Thermal[1B])

### Nets
+3V3: J20.1
GND: C41.1 R37.1
NetC41_2: C41.2 R36.1 ; port NTC
NetJ20_2: J20.2 R36.2 R37.2

### Notes on the sheet
- Single 10k NTC Thermistor Interface
- 10kOhm NTC thermistor input.
- Sub-Project:
- Size:
- Drawn By:
- Revision:
- Date:
- File:
- Sheet:
- of

### Library data of the parts
?#4 = Standard Title Block
C41 = Non-polar Capacitor: Generic Ceramic Capacitor; Voltage: 6.3V; Value: 100nF
J20 = B2B-XH-A(LF)(SN): as J5 on sheet Power_Reset; Part Number: B2B-XH-A(LF)(SN); ComponentLink1Description: Datasheet; ComponentLink1URL: http://www.jst-mfg.com/product/pdf/eng/eXH.pdf; ComponentLink2Description: DigiKey Link; ComponentLink2URL: http://digikey.com/product-detail/en/jst-sales-america-inc/B2B-XH-A-LF-SN/455-2247-ND/1651045; Connector Type: Header; Contact Finish - Mating: Tin; Contact Finish - Post: Tin; Contact Material: Brass; Contact Shape: Square; Contact Type: Male Pin; Fastening Type: Detent Lock; Insulation Color: Natural; Insulation Height: 0.276" (7.00mm); Insulation Material: Polyamide (PA66), Nylon 6/6; LastUpdated: 1/12/2020 11:46:08 PM; Lifecycle Status: Active; Minimum Order: 1; Mounting Type: Through Hole; Number of Rows: 1; Operating Temperature: -25°C ~ 85°C; Packaging: Bulk; PartId: 67; Part Status: Active; Price: 0.15; Series: XH; Supplier 1: DigiKey; Supplier Part Number 1: 455-2247-ND; Termination: Press-Fit, Solder
R36 R37 = Resistor: Power: 1/8W
  R36: Value: 100R
  R37: Value: 6.8k

## Sheet Neopixel_Interface.SchDoc: Neopixel LED Interface
size A4; DrawnBy: Samyar Sadat Akhavi; Revision: 1.0; SheetNumber: 12; SheetTotal: 13
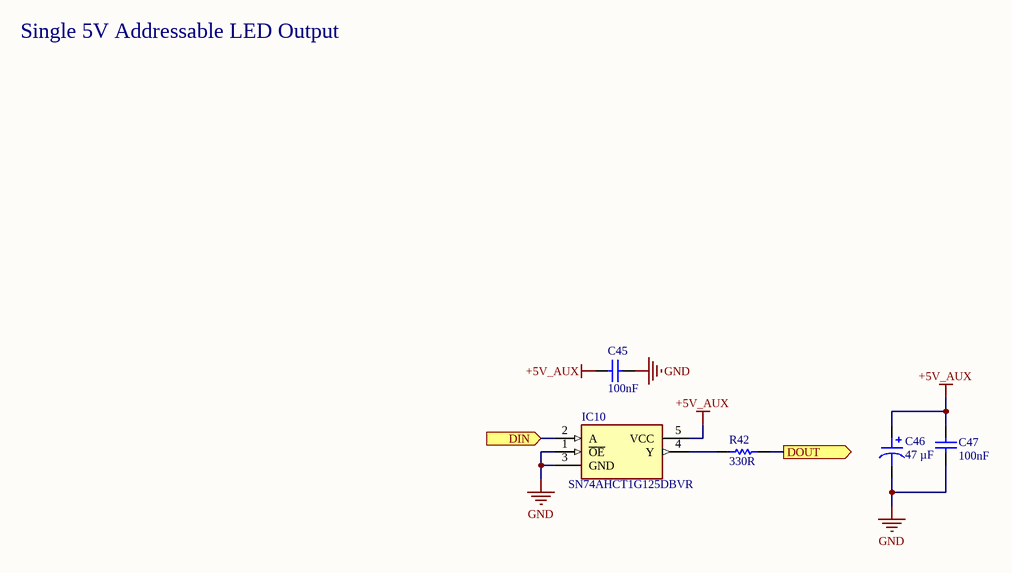
[diagram p6: Neopixel_Interface.SchDoc]

### Parts
(Parts that share a designator on the sheet are numbered #1, #2 ... from top to bottom, then left to right.)
?#5  (no value)  (graphical)
C45  100nF  [CAP_SMD_603]
C46  47 µF  [CAP ALSMD 6.6MM H5.4MM]
C47  100nF  [CAP_SMD_603]
IC10  SN74AHCT1G125DBVR  [SOT95P280X145-5N]
R42  330R  [RES_0603]

### Ports
DIN (in, see Lighting[1B]), DOUT (out, see Lighting[2B])

### Nets
+5V_AUX: C45.2 C46.1 C47.2 IC10.5(VCC)
GND: C45.1 C46.2 C47.1 IC10.1(~{OE}) IC10.3(GND)
NetIC10_2: IC10.2(A) ; port DIN
NetIC10_4: IC10.4(Y) R42.2
NetR42_1: R42.1 ; port DOUT

### Notes on the sheet
- Single 5V Addressable LED Output
- Sub-Project:
- Size:
- Drawn By:
- Revision:
- Date:
- File:
- Sheet:
- of

### Library data of the parts
?#5 = Standard Title Block
C45 C47 = Non-polar Capacitor: Generic Ceramic Capacitor; Voltage: 6.3V; Value: 100nF
C46 = 865080443007: CAP ALUM 47UF 20% 25V SMD; manufacturer: Würth Elektronik; Impedance: 560 mOhms; Lifetime @ Temp.: 2000 Hrs @ 105°C; Polarization: Polar; Ripple Current @ High Frequency: 220 mA @ 100 kHz; Ripple Current @ Low Frequency: 143 mA @ 120 Hz; Surface Mount Land Size: 0.260" L x 0.260" W (6.60mm x 6.60mm); Part Number: 865080443007; Applications: General Purpose; Capacitance: 47 µF; componentlink1description: Datasheet; componentlink1url: https://katalog.we-online.de/pbs/datasheet/865080443007.pdf; componentlink2description: DigiKey Link; componentlink2url: https://www.digikey.com/en/products/detail/würth-elektronik/865080443007/5728030; Device Package: Radial, Can - SMD; Height - Seated (Max): 0.217" (5.50mm); lastupdated: 6/3/2024 7:53:40 PM; Lifecycle Status: Active; Minimum Order: 1; Mounting Type: Surface Mount; Operating Temperature: -55°C ~ 105°C; Package / Case: Radial, Can - SMD; packaging: TapeAndReel; partid: 8980; Part Status: Active; price: 0.15; series: WCAP-ASLI; Size / Dimension: 0.248" Dia (6.30mm); Supplier 1: DigiKey; Supplier Part Number 1: 732-8435-1-ND; Tolerance: ±20%; value: 47 µF; Voltage - Rated: 25 V
IC10 = SN74AHCT1G125DBVR: as IC5 on sheet Ultrasonic_Interface; Datasheet Link: http://www.ti.com/lit/ds/symlink/sn74ahct1g125.pdf; Height: 1.45mm; Manufacturer_Part_Number: SN74AHCT1G125DBVR; Mouser Part Number: 595-SNAHCT1G125DBVR; Mouser Price/Stock: https://www.mouser.co.uk/ProductDetail/Texas-Instruments/SN74AHCT1G125DBVR?qs=N6WZOzgtpqVaVW8Lh%252BgevA%3D%3D; Arrow Part Number: SN74AHCT1G125DBVR; Arrow Price/Stock: https://www.arrow.com/en/products/sn74ahct1g125dbvr/texas-instruments?utm_currency=USD&region=nac
R42 = Resistor: Power: 1/8W; Value: 330R

## Sheet CC_LED_Drive.SchDoc: Constant-current LED Drive
size A4; DrawnBy: Samyar Sadat Akhavi; Revision: 1.0; SheetNumber: 13; SheetTotal: 14
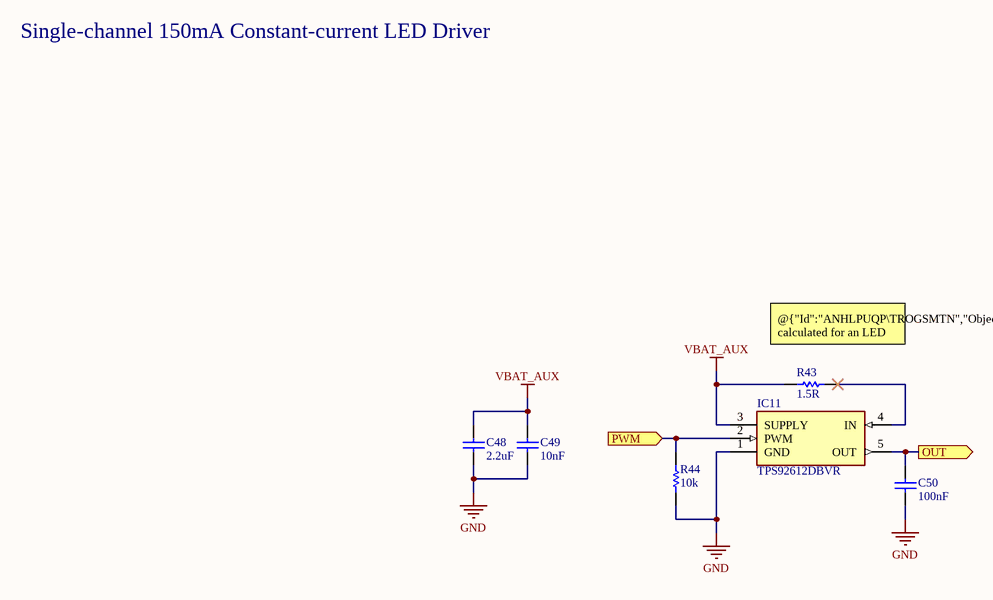
[diagram p7: CC_LED_Drive.SchDoc]

### Parts
(Parts that share a designator on the sheet are numbered #1, #2 ... from top to bottom, then left to right.)
?#6  (no value)  (graphical)
C48  2.2uF  [CAP_SMD_603]
C49  10nF  [CAP_SMD_603]
C50  100nF  [CAP_SMD_603]
IC11  TPS92612DBVR  [SOT95P280X145-5N]
R43  1.5R  [RES_0603]
R44  10k  [RES_0603]

### Ports
OUT (out, see Lighting[3A]), PWM (in, see Lighting[2A])

### Nets
GND: C48.1 C49.1 C50.1 IC11.1(GND) R44.2
VBAT_AUX: C48.2 C49.2 IC11.3(SUPPLY) R43.2
NetC50_2: C50.2 IC11.5(OUT) ; port OUT
NetIC11_2: IC11.2(PWM) R44.1 ; port PWM
NetIC11_4: IC11.4(IN) R43.1

### Notes on the sheet
- Single-channel 150mA Constant-current LED Driver
- (near R43) @{"Id":"ANHLPUQP\TROGSMTN","ObjectType":2} calculated for an LED current of 65mA.
- Sub-Project:
- Size:
- Drawn By:
- Revision:
- Date:
- File:
- Sheet:
- of

### Library data of the parts
?#6 = Standard Title Block
C48 C49 = Non-polar Capacitor: Generic Ceramic Capacitor; Voltage: 16V
  C48: Value: 2.2uF
  C49: Value: 10nF
C50 = Non-polar Capacitor: Generic Ceramic Capacitor; Voltage: 6.3V; Value: 100nF
IC11 = TPS92612DBVR: Integrated Circuit; Manufacturer_Name: Texas Instruments; Datasheet Link: https://www.ti.com/lit/gpn/TPS92612; Height: 1.45mm; Manufacturer_Part_Number: TPS92612DBVR; Mouser Part Number: 595-TPS92612DBVR; Mouser Price/Stock: https://www.mouser.co.uk/ProductDetail/Texas-Instruments/TPS92612DBVR?qs=vmHwEFxEFR8rIdrHkxYxuQ%3D%3D; Arrow Part Number: TPS92612DBVR; Arrow Price/Stock: https://www.arrow.com/en/products/tps92612dbvr/texas-instruments?utm_currency=USD&region=nac
R43 R44 = Resistor: Power: 1/8W
  R43: Value: 1.5R
  R44: Value: 10k

## Nets that join several sheets
+3V3: Power_Reset (5 pins), Sensors_IO (6 pins), MS1 (R34_MS1.1), MS2 (R34_MS2.1), MS3 (R34_MS3.1), MS4 (R34_MS4.1), Aux_Power_Bus (8 pins), Temp_Interface (J20.1)
+5V: Power_Reset (C23.2 C24.1 F2.2 R16.1), ULTRA1 (C29_ULTRA1.2 IC5_ULTRA1.5 J12_ULTRA1.1), ULTRA2 (C29_ULTRA2.2 IC5_ULTRA2.5 J12_ULTRA2.1), ULTRA3 (C29_ULTRA3.2 IC5_ULTRA3.5 J12_ULTRA3.1), ULTRA4 (C29_ULTRA4.2 IC5_ULTRA4.5 J12_ULTRA4.1), Aux_Power_Bus (R23.2 R25.2)
+5V_AUX: Aux_Power_Bus (IC6.1 R29.1), Neopixel_Interface (C45.2 C46.1 C47.2 IC10.5)
GND: Power_Reset (12 pins), Sensors_IO (6 pins), MS1 (C40_MS1.2 J13_MS1.2), MS2 (C40_MS2.2 J13_MS2.2), MS3 (C40_MS3.2 J13_MS3.2), MS4 (C40_MS4.2 J13_MS4.2), ULTRA1 (5 pins), ULTRA2 (5 pins), ULTRA3 (5 pins), ULTRA4 (5 pins), Aux_Power_Bus (17 pins), Temp_Interface (C41.1 R37.1), Neopixel_Interface (5 pins), CC_LED_Drive (5 pins)
VBAT: Power_Reset (C25.2 C26.1 F3.2 R15.1), Aux_Power_Bus (R24.2 R26.2)
VBAT_AUX: Aux_Power_Bus (IC7.1 R30.1), CC_LED_Drive (C48.2 C49.2 IC11.3 R43.2)